# EAGLE design IoTv14 (EAGLE 7.6.0)
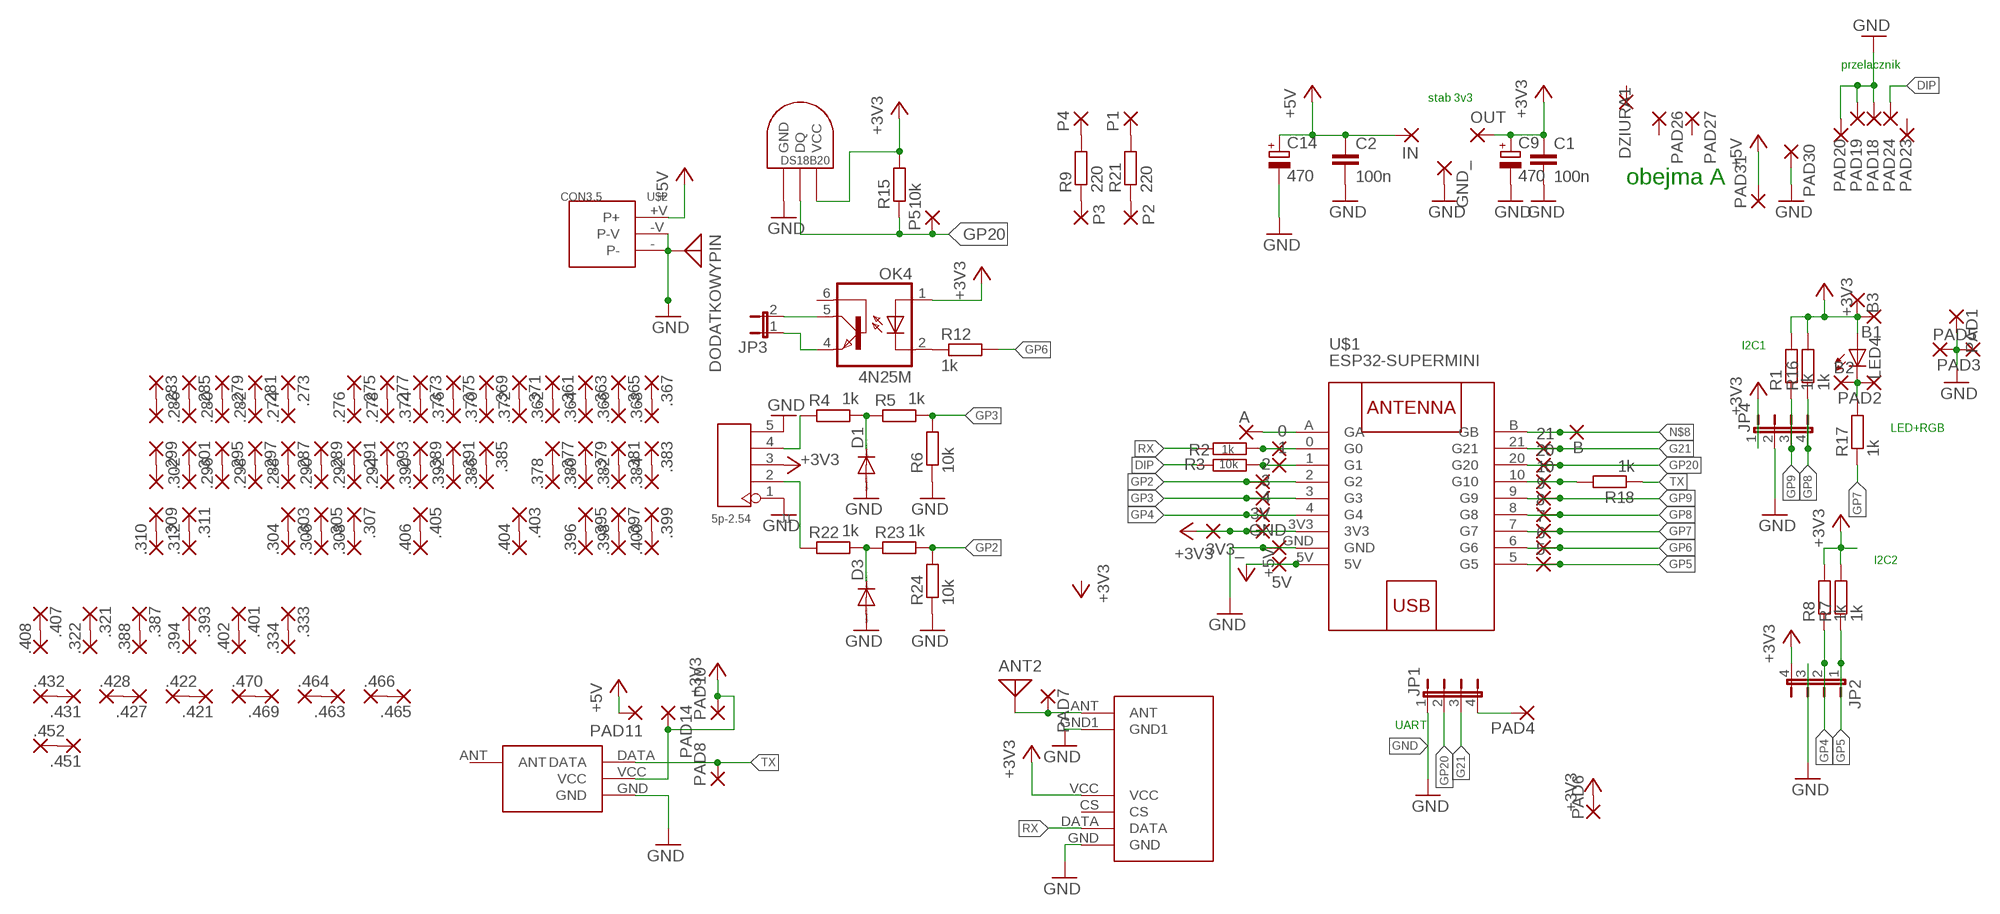
[diagram p0: schematic, sheet 1]

## Parts
0  1,6/0,8  [1,6/0,8]
1  1,6/0,8  [1,6/0,8]
2  1,6/0,8  [1,6/0,8]
3  1,6/0,8  [1,6/0,8]
3V  1,6/0,8  [1,6/0,8]
3V3_  1,6/0,8  [1,6/0,8]
4  1,6/0,8  [1,6/0,8]
5  1,6/0,8  [1,6/0,8]
5V  1,6/0,8  [1,6/0,8]
6  1,6/0,8  [1,6/0,8]
7  1,6/0,8  [1,6/0,8]
8  1,6/0,8  [1,6/0,8]
9  1,6/0,8  [1,6/0,8]
10  1,6/0,8  [1,6/0,8]
20  1,6/0,8  [1,6/0,8]
21  1,6/0,8  [1,6/0,8]
.273  1,6/0,8  [1,6/0,8]
.274  1,6/0,8  [1,6/0,8]
.275  1,6/0,8  [1,6/0,8]
.276  1,6/0,8  [1,6/0,8]
.277  1,6/0,8  [1,6/0,8]
.278  1,6/0,8  [1,6/0,8]
.279  1,6/0,8  [1,6/0,8]
.280  1,6/0,8  [1,6/0,8]
.281  1,6/0,8  [1,6/0,8]
.282  1,6/0,8  [1,6/0,8]
.283  1,6/0,8  [1,6/0,8]
.284  1,6/0,8  [1,6/0,8]
.285  1,6/0,8  [1,6/0,8]
.286  1,6/0,8  [1,6/0,8]
.287  1,6/0,8  [1,6/0,8]
.288  1,6/0,8  [1,6/0,8]
.289  1,6/0,8  [1,6/0,8]
.290  1,6/0,8  [1,6/0,8]
.291  1,6/0,8  [1,6/0,8]
.292  1,6/0,8  [1,6/0,8]
.293  1,6/0,8  [1,6/0,8]
.294  1,6/0,8  [1,6/0,8]
.295  1,6/0,8  [1,6/0,8]
.296  1,6/0,8  [1,6/0,8]
.297  1,6/0,8  [1,6/0,8]
.298  1,6/0,8  [1,6/0,8]
.299  1,6/0,8  [1,6/0,8]
.300  1,6/0,8  [1,6/0,8]
.301  1,6/0,8  [1,6/0,8]
.302  1,6/0,8  [1,6/0,8]
.303  1,6/0,8  [1,6/0,8]
.304  1,6/0,8  [1,6/0,8]
.305  1,6/0,8  [1,6/0,8]
.306  1,6/0,8  [1,6/0,8]
.307  1,6/0,8  [1,6/0,8]
.308  1,6/0,8  [1,6/0,8]
.309  1,6/0,8  [1,6/0,8]
.310  1,6/0,8  [1,6/0,8]
.311  1,6/0,8  [1,6/0,8]
.312  1,6/0,8  [1,6/0,8]
.321  1,6/0,8  [1,6/0,8]
.322  1,6/0,8  [1,6/0,8]
.333  1,6/0,8  [1,6/0,8]
.334  1,6/0,8  [1,6/0,8]
.361  1,6/0,8  [1,6/0,8]
.362  1,6/0,8  [1,6/0,8]
.363  1,6/0,8  [1,6/0,8]
.364  1,6/0,8  [1,6/0,8]
.365  1,6/0,8  [1,6/0,8]
.366  1,6/0,8  [1,6/0,8]
.367  1,6/0,8  [1,6/0,8]
.368  1,6/0,8  [1,6/0,8]
.369  1,6/0,8  [1,6/0,8]
.370  1,6/0,8  [1,6/0,8]
.371  1,6/0,8  [1,6/0,8]
.372  1,6/0,8  [1,6/0,8]
.373  1,6/0,8  [1,6/0,8]
.374  1,6/0,8  [1,6/0,8]
.375  1,6/0,8  [1,6/0,8]
.376  1,6/0,8  [1,6/0,8]
.377  1,6/0,8  [1,6/0,8]
.378  1,6/0,8  [1,6/0,8]
.379  1,6/0,8  [1,6/0,8]
.380  1,6/0,8  [1,6/0,8]
.381  1,6/0,8  [1,6/0,8]
.382  1,6/0,8  [1,6/0,8]
.383  1,6/0,8  [1,6/0,8]
.384  1,6/0,8  [1,6/0,8]
.385  1,6/0,8  [1,6/0,8]
.386  1,6/0,8  [1,6/0,8]
.387  1,6/0,8  [1,6/0,8]
.388  1,6/0,8  [1,6/0,8]
.389  1,6/0,8  [1,6/0,8]
.390  1,6/0,8  [1,6/0,8]
.391  1,6/0,8  [1,6/0,8]
.392  1,6/0,8  [1,6/0,8]
.393  1,6/0,8  [1,6/0,8]
.394  1,6/0,8  [1,6/0,8]
.395  1,6/0,8  [1,6/0,8]
.396  1,6/0,8  [1,6/0,8]
.397  1,6/0,8  [1,6/0,8]
.398  1,6/0,8  [1,6/0,8]
.399  1,6/0,8  [1,6/0,8]
.400  1,6/0,8  [1,6/0,8]
.401  1,6/0,8  [1,6/0,8]
.402  1,6/0,8  [1,6/0,8]
.403  1,6/0,8  [1,6/0,8]
.404  1,6/0,8  [1,6/0,8]
.405  1,6/0,8  [1,6/0,8]
.406  1,6/0,8  [1,6/0,8]
.407  1,6/0,8  [1,6/0,8]
.408  1,6/0,8  [1,6/0,8]
.421  1,6/0,8  [1,6/0,8]
.422  1,6/0,8  [1,6/0,8]
.427  1,6/0,8  [1,6/0,8]
.428  1,6/0,8  [1,6/0,8]
.431  1,6/0,8  [1,6/0,8]
.432  1,6/0,8  [1,6/0,8]
.451  1,6/0,8  [1,6/0,8]
.452  1,6/0,8  [1,6/0,8]
.463  1,6/0,8  [1,6/0,8]
.464  1,6/0,8  [1,6/0,8]
.465  1,6/0,8  [1,6/0,8]
.466  1,6/0,8  [1,6/0,8]
.469  1,6/0,8  [1,6/0,8]
.470  1,6/0,8  [1,6/0,8]
A  1,6/0,8  [1,6/0,8]
ANT2  ANTENNA  [PAD-01]
B  1,6/0,8  [1,6/0,8]
B1  1,6/0,8  [1,6/0,8]
B2  1,6/0,8  [1,6/0,8]
B3  1,6/0,8  [1,6/0,8]
C1  100n  C5/2.5  [C5B2.5]
C2  100n  C5/2.5  [C5B2.5]
C9  470  CPOL-EUE2,5-6E  [E2,5-6E]
C14  470  CPOL-EUE2,5-6E  [E2,5-6E]
D1  DIODE-DO41-7.6  [DO41-7.6]
D3  DIODE-DO41-7.6  [DO41-7.6]
DODATKOWYPIN  ANTENNA  [PAD-01]
DZIURA1  3,81/1,4  [3,81/1,4]
GND  1,6/0,8  [1,6/0,8]
GND_  1,6/0,9  [1,6/0,9]
IN  1,6/0,9  [1,6/0,9]
J1  5p-2.54  DIP-BLACK-FEMALE-HEADER-VERT(5P-2.54)  [H5-2.54]
JP1  JP4E  [JP4]
JP2  JP4E  [JP4]
JP3  JP1E  [JP1]
JP4  JP4E  [JP4]
LED4  LED3MM  [LED3MM]
OK4  4N25M  [DIL06]
OUT  1,6/0,9  [1,6/0,9]
P1  1,6/0,8  [1,6/0,8]
P2  1,6/0,8  [1,6/0,8]
P3  1,6/0,8  [1,6/0,8]
P4  1,6/0,8  [1,6/0,8]
P5  1,6/0,8  [1,6/0,8]
PAD1  1,6/0,8  [1,6/0,8]
PAD2  1,6/0,8  [1,6/0,8]
PAD3  1,6/0,8  [1,6/0,8]
PAD4  1,6/0,8  [1,6/0,8]
PAD5  1,6/0,8  [1,6/0,8]
PAD6  1,6/0,8  [1,6/0,8]
PAD7  1,6/0,8  [1,6/0,8]
PAD8  1,6/0,8  [1,6/0,8]
PAD10  1,6/0,8  [1,6/0,8]
PAD11  1,6/0,8  [1,6/0,8]
PAD14  1,6/0,8  [1,6/0,8]
PAD18  2,15/1,0  [2,15/1,0]
PAD19  2,15/1,0  [2,15/1,0]
PAD20  3,81/1,4  [3,81/1,4]
PAD23  3,81/1,4  [3,81/1,4]
PAD24  2,15/1,0  [2,15/1,0]
PAD26  2,15/1,0  [2,15/1,0]
PAD27  2,15/1,0  [2,15/1,0]
PAD30  3,81/1,4  [3,81/1,4]
PAD31  3,81/1,4  [3,81/1,4]
R1  1k  R-EU_0204/7  [0204/7]
R2  1k  R-EU_0204/7  [0204/7]
R3  10k  R-EU_0204/7  [0204/7]
R4  1k  R-EU_0204/7  [0204/7]
R5  1k  R-EU_0204/7  [0204/7]
R6  10k  R-EU_0204/7  [0204/7]
R7  1k  R-EU_0204/7  [0204/7]
R8  1k  R-EU_0204/7  [0204/7]
R9  220  R-EU_0204/7  [0204/7]
R12  1k  R-EU_0204/7  [0204/7]
R15  10k  R-EU_0204/7  [0204/7]
R16  1k  R-EU_0204/7  [0204/7]
R17  1k  R-EU_0204/7  [0204/7]
R18  1k  R-EU_0204/7  [0204/7]
R21  220  R-EU_0204/7  [0204/7]
R22  1k  R-EU_0204/7  [0204/7]
R23  1k  R-EU_0204/7  [0204/7]
R24  10k  R-EU_0204/7  [0204/7]
U$1  ESP32-SUPERMINI  [ESP32-SUPERMINI]
U$2  CON3.5  [CON3.5]
U$9  DS1820TO92  [DS1820]
U$10  STX882  [STX882]
U$11  SRX822  [SRX882]

## Nets
+3V3: 3V3_.1(P) 3V.1(P) B1.1(P) B3.1(P) C1.1 C9.+ J1.3 JP2.4 JP4.1 LED4.A OK4.1(A) OUT.1(P) PAD6.1(P) PAD10.1(P) PAD14.1(P) R1.2 R7.2 R8.2 R15.2 R16.2 U$1.3V3 U$9.VDD(VCC) U$10.VCC U$11.VCC
+5V: 5V.1(P) C2.1 C14.+ IN.1(P) PAD11.1(P) PAD31.1(P) U$1.5V U$2.+V(P+)
DIP: PAD24.1(P) R3.2
G21: 21.1(P) JP1.3 U$1.21(G21)
GND: C1.2 C2.2 C9.- C14.- D1.A D3.A DODATKOWYPIN.1 GND.1(P) GND_.1(P) J1.1 J1.5 JP1.1 JP2.3 JP4.2 PAD1.1(P) PAD3.1(P) PAD5.1(P) PAD18.1(P) PAD19.1(P) PAD20.1(P) PAD30.1(P) R6.1 R24.1 U$1.GND U$2.- U$2.-V U$9.GND U$10.GND U$11.GND U$11.GND1
GP2: 2.1(P) R23.2 R24.2 U$1.2(G2)
GP3: 3.1(P) R5.2 R6.2 U$1.3(G3)
GP4: 4.1(P) JP2.2 R8.1 U$1.4(G4)
GP5: 5.1(P) JP2.1 R7.1 U$1.5(G5)
GP6: 6.1(P) R12.2 U$1.6(G6)
GP7: 7.1(P) R17.1 U$1.7(G7)
GP8: 8.1(P) JP4.4 R16.1 U$1.8(G8)
GP9: 9.1(P) JP4.3 R1.1 U$1.9(G9)
GP20: 20.1(P) JP1.2 P5.1(P) R15.1 U$1.20(G20) U$9.DQ
N$1: 0.1(P) R2.2 U$1.0(G0)
N$2: 1.1(P) R3.1 U$1.1(G1)
N$3: 10.1(P) R18.2 U$1.10(G10)
N$4: D1.C R4.2 R5.1
N$5: JP3.2 OK4.5(COL)
N$6: J1.4 R4.1
N$7: J1.2 R22.1
N$8: B.1(P) U$1.B(GB)
N$9: JP1.4 PAD4.1(P)
N$10: A.1(P) U$1.A(GA)
N$11: P1.1(P) R21.2
N$12: P3.1(P) R9.1
N$13: P4.1(P) R9.2
N$42: JP3.1 OK4.4(EMI)
N$43: ANT2.1 PAD7.1(P) U$11.ANT
N$172: .273.1(P) .274.1(P)
N$173: .275.1(P) .276.1(P)
N$174: .277.1(P) .278.1(P)
N$175: .279.1(P) .280.1(P)
N$176: .281.1(P) .282.1(P)
N$177: .283.1(P) .284.1(P)
N$178: .285.1(P) .286.1(P)
N$179: .287.1(P) .288.1(P)
N$180: .289.1(P) .290.1(P)
N$181: .291.1(P) .292.1(P)
N$182: .293.1(P) .294.1(P)
N$183: .295.1(P) .296.1(P)
N$184: .297.1(P) .298.1(P)
N$185: .299.1(P) .300.1(P)
N$186: .301.1(P) .302.1(P)
N$187: .303.1(P) .304.1(P)
N$188: .305.1(P) .306.1(P)
N$189: .307.1(P) .308.1(P)
N$190: .309.1(P) .310.1(P)
N$191: .311.1(P) .312.1(P)
N$196: .321.1(P) .322.1(P)
N$202: .333.1(P) .334.1(P)
N$216: .361.1(P) .362.1(P)
N$217: .363.1(P) .364.1(P)
N$218: .365.1(P) .366.1(P)
N$219: .367.1(P) .368.1(P)
N$220: .369.1(P) .370.1(P)
N$221: .371.1(P) .372.1(P)
N$222: .373.1(P) .374.1(P)
N$223: .375.1(P) .376.1(P)
N$224: .377.1(P) .378.1(P)
N$225: .379.1(P) .380.1(P)
N$226: .381.1(P) .382.1(P)
N$227: .383.1(P) .384.1(P)
N$228: .385.1(P) .386.1(P)
N$229: .387.1(P) .388.1(P)
N$230: .389.1(P) .390.1(P)
N$231: .391.1(P) .392.1(P)
N$232: .393.1(P) .394.1(P)
N$233: .395.1(P) .396.1(P)
N$234: .397.1(P) .398.1(P)
N$235: .399.1(P) .400.1(P)
N$236: .401.1(P) .402.1(P)
N$237: .403.1(P) .404.1(P)
N$238: .405.1(P) .406.1(P)
N$239: .407.1(P) .408.1(P)
N$246: .421.1(P) .422.1(P)
N$249: .427.1(P) .428.1(P)
N$251: .431.1(P) .432.1(P)
N$261: .451.1(P) .452.1(P)
N$267: .463.1(P) .464.1(P)
N$268: .465.1(P) .466.1(P)
N$270: .469.1(P) .470.1(P)
N$273: B2.1(P) LED4.K(C) PAD2.1(P) R17.2
N$281: P2.1(P) R21.1
N$283: D3.C R22.2 R23.1
N$288: OK4.2(C) R12.1
RX: R2.1 U$11.DATA
TX: PAD8.1(P) R18.1 U$10.DATA
Unconnected: DZIURA1.1(P) OK4.6(BAS) PAD23.1(P) PAD26.1(P) PAD27.1(P) U$10.ANT U$11.CS

## Notes on the sheet
- przelacznik
- stab 3v3
- obejma A
- I2C1
- LED+RGB
- I2C2
- UART

## Library data of the parts
0 1-3 3V 3V3_ 4 5 5V 6-10 20 21 .273-.312 .321 .322 .333 .334 .361-.408 .421 .422 .427 .428 .431 .432 .451 .452 .463-.466 .469 .470 A B B1-B3 GND P1-P5 PAD1-PAD8 PAD10 PAD11 PAD14 = wirepad:1,6/0,8: THROUGH-HOLE PAD
ANT2 DODATKOWYPIN = moja2:ANTENNA: Antenna
C1 C2 = capacitor-wima:C: CAPACITOR naming: grid - package width
C9 C14 = resistor:CPOL-EU: POLARIZED CAPACITOR, European symbol
D1 D3 = diode:DIODE-: DIODE
DZIURA1 PAD20 PAD23 PAD30 PAD31 = wirepad:3,81/1,4: THROUGH-HOLE PAD
GND_ IN OUT = wirepad:1,6/0,9: THROUGH-HOLE PAD
J1 = Seeed-OPL-Connector:DIP-BLACK-FEMALE-HEADER-VERT(5P-2.54): 320030028; MPN: F185-1105A0BSYA1
JP1 JP2 JP4 = jumper:JP4E: JUMPER
JP3 = jumper:JP1E: JUMPER
LED4 = czesci:LED: LED OSRAM: - CHIPLED LG R971, LG N971, LY N971, LG Q971, LY Q971, LO R971, LY R971 LH N974, LH R974 LS Q976, LO Q976, LY Q976 LO Q996 - Hyper CHIPLED LW Q18S LB Q993, LB Q99A, LB R99A - SideLED LS A670, LO A670, LY A670, LG A670, LP A670 LB A673, LV A673, LT A673, LW A673 LH A674 LY A675 LS A676, LA A676, LO A676, LY A676, LW A676 LS A679, LY A679, LG A679 - Hyper Micro SIDELED® LS Y876, LA Y876, LO Y876, LY Y876 LT Y87S - SmartLED LW L88C, LW L88S LB L89C, LB L89S, LG L890 LS L89K, LO L89K, LY L89K LS L896, LA L896, LO L896, LY L896 - TOPLED LS T670, LO T670, LY T670, LG T670, LP T670 LSG T670, LSP T670, LSY T670, LOP T670, LYG T670 LG T671, LOG T671, LSG T671 LB T673, LV T673, LT T673, LW T673 LH T674 LS T676, LA T676, LO T676, LY T676, LB T676, LH T676, LSB T676, LW T676 LB T67C, LV T67C, LT T67C, LS T67K, LO T67K, LY T67K, LW E67C LS E67B, LA E67B, LO E67B, LY E67B, LB E67C, LV E67C, LT E67C LW T67C LS T679, LY T679, LG T679 LS T770, LO T770, LY T770, LG T770, LP T770 LB T773, LV T773, LT T773, LW T773 LH T774 LS E675, LA E675, LY E675, LS T675 LS T776, LA T776, LO T776, LY T776, LB T776 LHGB T686 LT T68C, LB T68C - Hyper Mini TOPLED® LB M676 - Mini TOPLED Santana® LG M470 LS M47K, LO M47K, LY M47K Source: http://www.osram.convergy.de LUXEON: - LUMILED® LXK2-PW12-R00, LXK2-PW12-S00, LXK2-PW14-U00, LXK2-PW14-V00 LXK2-PM12-R00, LXK2-PM12-S00, LXK2-PM14-U00 LXK2-PE12-Q00, LXK2-PE12-R00, LXK2-PE12-S00, LXK2-PE14-T00, LXK2-PE14-U00 LXK2-PB12-K00, LXK2-PB12-L00, LXK2-PB12-M00, LXK2-PB14-N00, LXK2-PB14-P00, LXK2-PB14-Q00 LXK2-PR12-L00, LXK2-PR12-M00, LXK2-PR14-Q00, LXK2-PR14-R00 LXK2-PD12-Q00, LXK2-PD12-R00, LXK2-PD12-S00 LXK2-PH12-R00, LXK2-PH12-S00 LXK2-PL12-P00, LXK2-PL12-Q00, LXK2-PL12-R00 Source: www.luxeon.com KINGBRIGHT: KA-3528ASYC Source: www.kingbright.com
OK4 = optocoupler:4N*?M: General Purpose 6-Pin Phototransistor Optocouplers Source: http://www.fairchildsemi.com/ds/4N/4N35-M.pdf; MPN: 4N25-M; OC_FARNELL: 1021349; OC_NEWARK: 98K9084
PAD18 PAD19 PAD24 PAD26 PAD27 = wirepad:2,15/1,0: THROUGH-HOLE PAD
R1-R9 R12 R15-R18 R21-R24 = resistor:R-EU_: RESISTOR, European symbol
U$1 = ESP32supermini:ESP32-SUPERMINI: WEMOS D1 mini: Mini Wi-Fi Board based on ESP-8266 device More details can be found here: https://www.wemos.cc/product/d1-mini.html Click here to find device on ebay.com <http://www.ebay.com/sch/wemos+d1+mini+nodemcu>
U$2 = connector3.5:CON3.5
U$9 = Ava:DS1820: DS18B20 Programmable Resolution 1-Wire Digital Thermometer Description The DS18B20 digital thermometer provides 9-bit to 12-bit Celsius temperature measurements and has an alarm function with nonvolatile user-programmable upper and lower trigger points. The DS18B20 communicates over a 1-Wire® bus that by definition requires only one data line (and ground) for communication with a central microprocessor. It has an operating temperature range of -55°C to +125°C and is accurate to ±0.5°C over the range of -10°C to +85°C. In addition, the DS18B20 can derive power directly from the data line ("parasite power"), eliminating the need for an external power supply. Each DS18B20 has a unique 64-bit serial code, which allows multiple DS18B20s to function on the same 1-Wire bus. Thus, it is simple to use one microprocessor to control many DS18B20s distributed over a large area. Applications that can benefit from this feature include HVAC environmental controls, temperature monitoring systems inside buildings, equipment, or machinery, and process monitoring and control systems.
U$10 = stx882:STX882
U$11 = srx882:SRX822

## Board
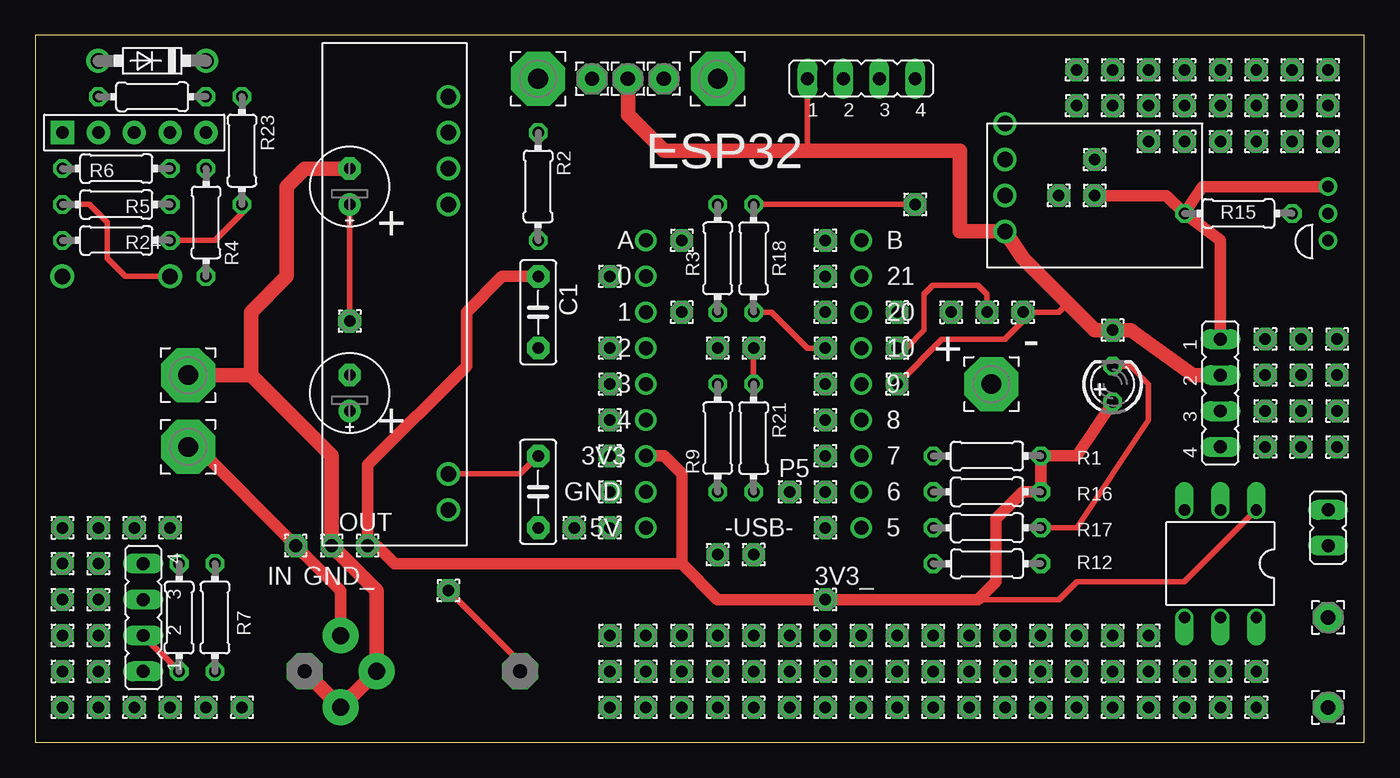
[diagram p1: board, top side]
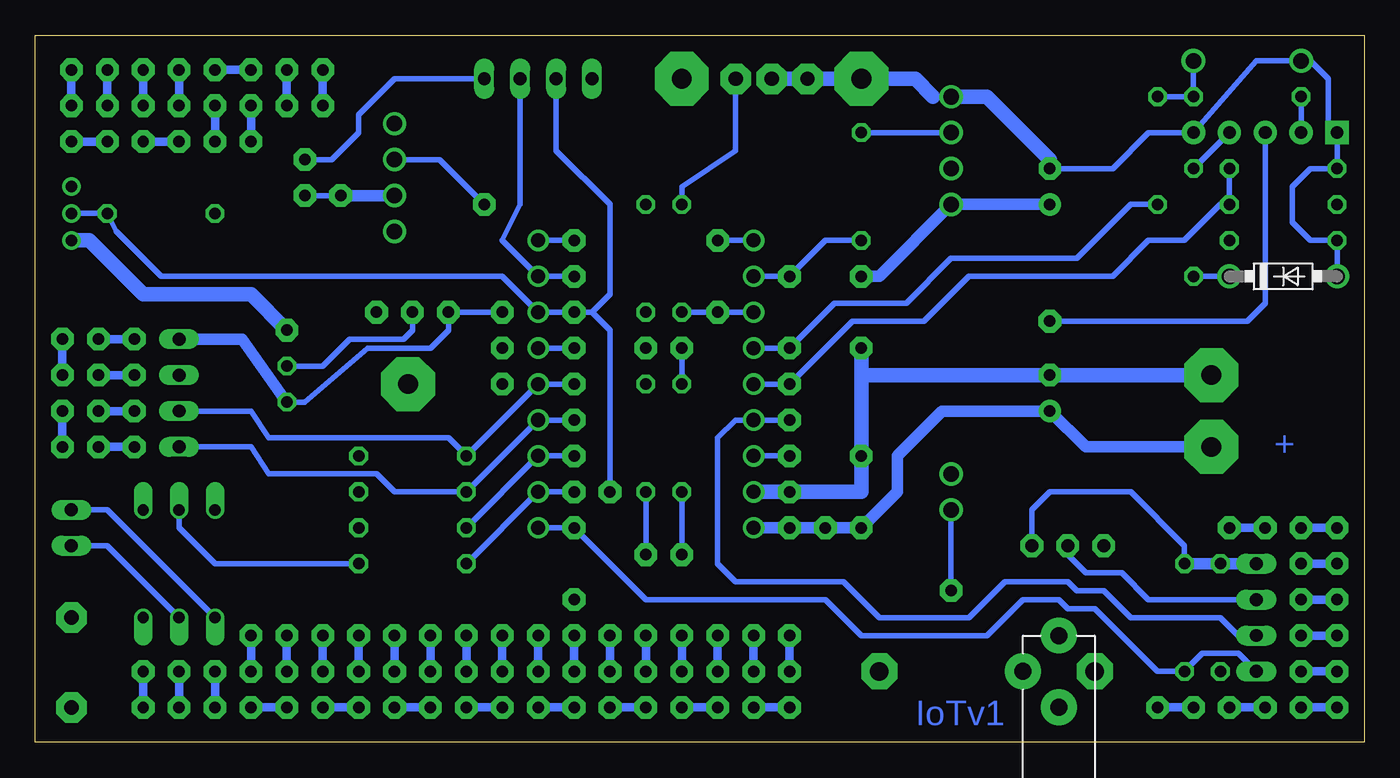
[diagram p2: board, bottom side, seen from below]

Size 94 x 50 mm. Coordinates in mm from the lower left corner, seen from the top.
Outline: 0,0 94,0 94,50 0,50 0,0
Copper layers (1*16): Top 0.035mm / dielectric 1.5mm / Bottom 0.035mm
Design rules "default *": minimum track width 10mil, minimum drill 24mil, track to track 8mil, track to pad 8mil, pad to pad 8mil, via to via 8mil, smd to smd 8mil, copper to edge 40mil, drill to drill 8mil, minimum pad ring 10mil, minimum via ring 8mil, stop-mask expansion 4mil, vias tented up to drill 0mil, thermal gap 10mil

### Footprints (pad centres in the part's own frame; a part is rotated, then mirrored left to right if it is on the bottom)
1,6/0,8 = drill 0.813 pad 1.6 octagon: 1 0,0
PAD-01 = drill 1.321 pad 2.54 octagon: 1 0,0
C5B2.5 = drill 0.813 pad 1.6 octagon: 1 -2.54,0; 2 2.54,0
E2,5-6E = drill 0.813 pad 1.575: + -1.27,0 | drill 0.813 pad 1.575 octagon: - 1.27,0
DO41-7.6 = drill 1.1 pad 1.7: A 3.81,0; C -3.81,0
3,81/1,4 = drill 1.397 pad 3.81 octagon: 1 0,0
1,6/0,9 = drill 0.914 pad 1.6 octagon: 1 0,0
H5-2.54 = drill 0.889 pad 1.651 square: 1 0,5.08 | drill 0.889 pad 1.651: 2 0,2.54; 3 0,0; 4 0,-2.54; 5 0,-5.08
JP4 = drill 0.914 long: 1 -3.81,0; 2 -1.27,0; 3 1.27,0; 4 3.81,0
JP1 = drill 0.914 long: 1 0,-1.27; 2 0,1.27
LED3MM = drill 0.813 octagon: A -1.27,0; K 1.27,0
DIL06 = drill 0.813 offset: 1 -2.54,-3.81; 2 0,-3.81; 3 2.54,-3.81; 4 2.54,3.81; 5 0,3.81; 6 -2.54,3.81
2,15/1,0 = drill 1.016 pad 2.159 octagon: 1 0,0
0204/7 = drill 0.813 octagon: 1 -3.81,0; 2 3.81,0
ESP32-SUPERMINI = drill 1: 0 -11.43,9.525; 1 -11.43,6.985; 2 -11.43,4.445; 3 -11.43,1.905; 3V3 -11.43,-3.175; 4 -11.43,-0.635; 5 3.81,-8.255; 5V -11.43,-8.255; 6 3.81,-5.715; 7 3.81,-3.175; 8 3.81,-0.635; 9 3.81,1.905; 10 3.81,4.445; 20 3.81,6.985; 21 3.81,9.525; A -11.43,12.065; B 3.81,12.065; GND -11.43,-5.715
CON3.5 = drill 1.2 pad 2.54: +V 2.54,-1.27; - -2.54,-1.27; -V 0,1.27
DS1820 = drill 0.8: DQ 2.54,-1.27; GND 0.635,-1.27; VDD 4.445,-1.27
STX882 = drill 1.1: ANT 6.35,-5.08; DATA 6.35,-2.54; GND 6.35,2.54; VCC 6.35,0
SRX882 = drill 1.1: ANT -15.24,-3.81; CS 8.89,-3.81; DATA 11.43,-3.81; GND 13.97,-3.81; GND1 -12.7,-3.81; VCC 6.35,-3.81

### Placement (x,y rotation side)
0  40.65,32.96 0 top
1  45.73,30.42 0 top
2  40.65,27.88 0 top
3  40.65,25.34 0 top
3V  40.65,20.26 0 top
3V3_  55.89,10.1 0 top
4  40.65,22.8 0 top
5  55.89,15.18 0 top
5V  40.65,15.18 0 top
6  55.89,17.72 0 top
7  55.89,20.26 0 top
8  55.89,22.8 0 top
9  55.89,25.34 0 top
10  55.89,27.88 0 top
20  55.89,30.42 0 top
21  55.89,32.96 0 top
.273  83.83,45.03 0 top
.274  83.83,47.56 0 top
.275  88.91,47.56 0 top
.276  88.91,45.03 0 top
.277  91.45,45.03 0 top
.278  91.45,47.56 0 top
.279  83.83,2.48 0 top
.280  83.83,5.02 0 top
.281  91.45,42.48 0 top
.282  88.91,42.48 0 top
.283  73.67,45.03 0 top
.284  73.67,47.56 0 top
.285  76.21,45.03 0 top
.286  76.21,47.56 0 top
.287  60.97,2.48 0 top
.288  63.51,2.48 0 top
.289  81.29,47.56 0 top
.290  78.75,47.56 0 top
.291  81.29,45.03 0 top
.292  81.29,42.48 0 top
.293  86.37,47.56 0 top
.294  86.37,45.03 0 top
.295  73.67,7.56 0 top
.296  73.67,5.02 0 top
.297  83.83,42.48 0 top
.298  86.37,42.48 0 top
.299  76.21,2.48 0 top
.300  78.75,2.48 0 top
.301  68.59,2.48 0 top
.302  66.05,2.48 0 top
.303  40.65,5.02 0 top
.304  40.65,7.56 0 top
.305  71.13,2.48 0 top
.306  73.67,2.48 0 top
.307  89.55,23.44 0 top
.308  87.01,23.44 0 top
.309  78.75,42.48 0 top
.310  78.75,45.03 0 top
.311  81.29,2.48 0 top
.312  81.29,5.02 0 top
.321  1.92,15.18 90 top
.322  4.46,15.18 90 top
.333  86.37,2.48 0 top
.334  86.37,5.02 0 top
.361  40.65,2.48 0 top
.362  43.19,2.48 0 top
.363  45.73,2.48 0 top
.364  48.27,2.48 0 top
.365  78.75,7.56 0 top
.366  78.75,5.02 0 top
.367  50.81,5.02 0 top
.368  50.81,7.56 0 top
.369  48.27,5.02 0 top
.370  48.27,7.56 0 top
.371  53.35,7.56 0 top
.372  53.35,5.02 0 top
.373  58.43,5.02 0 top
.374  58.43,7.56 0 top
.375  60.97,7.56 0 top
.376  60.97,5.02 0 top
.377  45.73,5.02 0 top
.378  45.73,7.56 0 top
.379  55.89,7.56 0 top
.380  55.89,5.02 0 top
.381  50.81,2.48 0 top
.382  53.35,2.48 0 top
.383  58.43,2.48 0 top
.384  55.89,2.48 0 top
.385  63.51,5.02 90 top
.386  63.51,7.56 90 top
.387  4.46,10.1 90 top
.388  1.92,10.1 90 top
.389  71.13,5.02 90 top
.390  71.13,7.56 90 top
.391  66.05,5.02 90 top
.392  66.05,7.56 90 top
.393  4.46,7.56 90 top
.394  1.92,7.56 90 top
.395  68.59,5.02 90 top
.396  68.59,7.56 90 top
.397  76.21,7.56 90 top
.398  76.21,5.02 90 top
.399  87.01,20.9 90 top
.400  89.55,20.9 90 top
.401  1.92,5.02 90 top
.402  4.46,5.02 90 top
.403  87.01,25.98 90 top
.404  89.55,25.98 90 top
.405  92.09,23.44 90 top
.406  92.09,20.9 90 top
.407  4.46,12.64 90 top
.408  1.92,12.64 90 top
.421  7,2.48 0 top
.422  9.54,2.48 0 top
.427  92.09,28.52 0 top
.428  92.09,25.98 0 top
.431  43.19,7.56 0 top
.432  43.19,5.02 0 top
.451  87.01,28.52 0 top
.452  89.55,28.52 0 top
.463  7,15.18 0 top
.464  9.54,15.18 0 top
.465  1.92,2.48 0 top
.466  4.46,2.48 0 top
.469  14.61,2.48 0 top
.470  12.07,2.48 0 top
A  45.73,35.5 0 top
ANT2  34.3,5.02 0 top
B  55.89,35.5 0 top
B1  64.78,30.42 90 top
B2  60.97,27.88 0 top
B3  60.97,30.42 0 top
C1  35.57,30.42 270 top
C2  35.57,17.72 90 top
C9  22.23,39.31 90 top
C14  22.23,24.7 90 top
D1  5.73,32.96 0 bottom
D3  8.27,48.2 180 top
DODATKOWYPIN  19.06,5.02 0 top
DZIURA1  67.64,25.34 0 top
GND  40.65,17.72 0 top
GND_  20.96,13.91 0 top
IN  18.43,13.91 0 top
J1  7,43.12 90 top
JP1  58.43,46.93 0 top
JP2  7.63,8.83 90 top
JP3  91.45,15.18 180 top
JP4  83.83,24.7 270 top
LED4  76.21,25.34 90 top
OK4  83.83,12.64 180 top
OUT  23.5,13.91 0 top
P1  50.81,13.27 0 top
P2  50.81,27.88 0 top
P3  48.27,13.27 0 top
P4  48.27,27.88 0 top
P5  53.35,17.72 0 top
PAD1  76.21,29.15 0 top
PAD2  67.32,30.42 0 top
PAD3  69.86,30.42 90 top
PAD4  74.94,41.22 0 top
PAD5  60.97,25.34 0 top
PAD6  22.23,29.78 0 top
PAD7  29.22,10.73 0 top
PAD8  62.24,38.04 0 top
PAD10  74.94,38.67 0 top
PAD11  38.11,15.18 0 top
PAD14  72.4,38.67 0 top
PAD18  41.92,46.93 0 top
PAD19  39.38,46.93 0 top
PAD20  35.57,46.93 0 top
PAD23  48.27,46.93 0 top
PAD24  44.46,46.93 0 top
PAD26  91.45,8.83 0 top
PAD27  91.45,2.48 0 top
PAD30  10.8,25.98 0 top
PAD31  10.8,20.9 0 top
R1  67.32,20.26 0 top
R2  35.57,39.31 270 top
R3  48.27,34.23 90 top
R4  12.07,36.77 270 top
R5  5.73,38.04 0 top
R6  5.73,40.58 0 top
R7  12.71,8.83 90 top
R8  10.17,8.83 90 top
R9  48.27,21.53 90 top
R12  67.32,12.64 180 top
R15  85.1,37.41 180 top
R16  67.32,17.72 0 top
R17  67.32,15.18 0 top
R18  50.81,34.23 270 top
R21  50.81,21.53 270 top
R22  8.27,45.66 0 top
R23  14.61,41.85 270 top
R24  5.73,35.5 0 top
U$1  54.62,23.44 0 top
U$2  22.87,5.02 90 bottom
U$9  90.18,34.87 90 top
U$10  74.94,38.67 180 top
U$11  25.41,31.69 90 top

### Tracks (layer width: path | path; a pad name or v marks a point on that pad's centre or on a via)
+3V3
  Top 0.406: OK4.1 81.29,11.37 73.67,11.37 72.4,10.1 66.69,10.1 | 24.14,13.91 OUT.1 | C9.+ PAD6.1
  Top 0.813: LED4.A 73.67,20.26 R1.2 R16.2 69.86,17.72 67.95,15.81 67.95,11.37 66.69,10.1 3V3_.1 48.27,10.1 45.73,12.64 | 45.73,12.64 45.73,18.99 44.46,20.26 U$1.3V3 | PAD10.1 80.02,38.67 R15.2 | R15.2 82.56,39.31 U$9.VDD | R15.2 83.83,35.5 JP4.1 | C1.1 33.03,32.96 30.49,30.42 30.49,26.61 23.5,19.62 OUT.1 | 45.73,12.64 25.41,12.64 24.14,13.91
  Bottom 0.406: PAD14.1 PAD10.1 | 3V.1 U$1.3V3 | LED4.A 74.94,24.07 70.5,27.88 66.05,27.88 64.78,29.15 B1.1 B3.1 | R7.2 12.71,13.91 16.52,17.72 22.23,17.72 23.5,16.45 OUT.1 | J1.3 7,31.05 8.27,29.78 PAD6.1
  Bottom 0.813: JP4.1 79.39,28.52 LED4.A | R7.2 R8.2 JP2.4 | U$10.VCC PAD14.1 | C9.+ U$11.VCC 34.3,32.96 C1.1
+5V
  Top 0.813: U$2.+V 21.6,10.73 IN.1 11.44,20.9 PAD31.1
  Bottom 0.813: U$1.5V 5V.1 PAD11.1 C2.1 33.03,17.72 33.03,20.26 29.86,23.44 C14.+ 19.7,20.9 PAD31.1
DIP
  Bottom 0.406: PAD24.1 44.46,41.85 48.27,39.31 R3.2
G21
  Bottom 0.406: 21.1 U$1.21 60.97,35.5 59.7,38.04 JP1.3
GND
  Top 0.406: 73.03,31.05 72.4,30.42 PAD3.1 69.86,29.78 68.59,28.52 64.14,28.52 PAD5.1 | JP1.1 54.62,41.85 | U$11.GND1 34.3,18.99 C2.2
  Top 1.016: PAD18.1 41.92,44.39 44.46,41.85 54.62,41.85 65.42,41.85 65.42,36.14 U$10.GND 69.86,34.23 73.03,31.05 74.94,29.15 PAD1.1 77.48,29.15 81.92,25.98 JP4.2 | 15.25,25.98 20.96,20.26 GND_.1 24.14,10.73 U$2.-V U$2.- DODATKOWYPIN.1 | PAD30.1 15.25,25.98 | 15.25,25.98 15.25,30.42 17.79,32.96 17.79,39.31 19.06,40.58 C9.-
  Bottom 0.406: D3.A 3.82,48.2 2.55,46.93 2.55,43.75 J1.1 R6.1 3.82,40.58 5.09,39.31 5.09,36.77 3.82,35.5 R24.1 D1.A | 5.09,48.2 D3.A | D3.A 7.63,48.2 J1.5 15.25,43.12 17.79,40.58 C9.- 22.23,41.22 | U$11.GND 30.49,45.66 | JP2.3 15.25,10.1 17.15,12.01 19.7,12.01 20.96,13.27 GND_.1
  Bottom 1.016: U$1.GND GND.1 35.57,17.72 C2.2 35.57,25.98 | U$9.GND 90.18,35.5 86.37,31.69 78.75,31.69 PAD1.1 | 30.49,45.66 31.76,46.93 PAD20.1 PAD19.1 PAD18.1 | U$11.GND 26.68,45.66 22.23,41.22 | C1.2 35.57,25.98 | PAD30.1 C14.- 35.57,25.98
GP2
  Top 0.406: R23.2 14.61,37.41 12.71,35.5 R24.2
  Bottom 0.406: U$1.2 2.1 37.48,31.05 32.4,31.05 29.22,34.23 20.33,34.23 16.52,38.04 R23.2
GP3
  Bottom 0.406: U$1.3 3.1 36.21,29.78 31.12,29.78 27.95,32.96 17.79,32.96 15.25,35.5 12.71,35.5 10.17,38.04 R5.2 R6.2
GP4
  Top 0.406: R8.1 JP2.2
  Bottom 0.406: U$1.4 4.1 44.46,22.8 45.73,21.53 45.73,12.64 44.46,11.37 36.84,11.37 34.3,8.83 27.95,8.83 25.41,11.37 20.96,11.37 20.33,10.73 18.43,10.73 16.52,8.83 10.17,8.83 8.9,7.56 JP2.2
GP5
  Bottom 0.406: U$1.5 5.1 50.81,10.1 38.11,10.1 35.57,7.56 26.68,7.56 24.14,10.1 21.6,10.1 20.96,9.47 19.06,9.47 14.61,5.02 R7.1 11.44,6.29 8.9,6.29 JP2.1
GP6
  Bottom 0.406: R12.2 U$1.6 6.1
GP7
  Bottom 0.406: 7.1 U$1.7 R17.1
GP8
  Bottom 0.406: 8.1 U$1.8 R16.1 68.59,17.72 69.86,18.99 77.48,18.99 78.75,20.9 JP4.4
GP9
  Bottom 0.406: JP4.3 78.75,23.44 77.48,21.53 64.78,21.53 R1.1 U$1.9 9.1
GP20
  Bottom 0.406: U$9.DQ R15.1 88.28,36.14 85.1,32.96 60.97,32.96 U$1.20 20.1 54.62,30.42 | P5.1 53.35,29.15 54.62,30.42 | JP1.2 57.16,41.85 53.35,38.04 53.35,31.69 54.62,30.42
N$1
  Bottom 0.406: U$1.0 0.1 38.11,35.5 R2.2
N$2
  Bottom 0.406: R3.1 1.1 U$1.1
N$3
  Top 0.406: R18.2 52.08,30.42 54.62,27.88 10.1
  Bottom 0.406: 10.1 U$1.10
N$4
  Top 0.406: R5.1 3.82,38.04 5.09,36.77 5.09,34.23 6.36,32.96 D1.C
  Bottom 0.406: D1.C R4.2
N$5
  Bottom 0.406: OK4.5 88.91,13.91 JP3.2
N$6
  Bottom 0.406: J1.4 R4.1
N$7
  Bottom 0.406: J1.2 R22.1
N$8
  Bottom 0.406: U$1.B B.1
N$9
  Bottom 0.406: JP1.4 68.59,46.93 71.13,44.39 71.13,43.12 73.03,41.22 PAD4.1
N$10
  Bottom 0.406: U$1.A A.1
N$11
  Bottom 0.406: P1.1 R21.2
N$12
  Bottom 0.406: R9.1 P3.1
N$13
  Bottom 0.406: P4.1 R9.2
N$42
  Bottom 0.406: OK4.4 88.91,16.45 JP3.1
N$43
  Top 0.406: ANT2.1 34.3,5.66 PAD7.1
  Bottom 0.406: U$11.ANT PAD7.1
N$172
  Bottom 0.61: .274.1 .273.1
N$173
  Bottom 0.61: .276.1 .275.1
N$174
  Bottom 0.61: .278.1 .277.1
N$175
  Bottom 0.61: .280.1 .279.1
N$176
  Bottom 0.61: .282.1 .281.1
N$177
  Bottom 0.61: .284.1 .283.1
N$178
  Bottom 0.61: .286.1 .285.1
N$179
  Bottom 0.61: .288.1 .287.1
N$180
  Bottom 0.61: .290.1 .289.1
N$181
  Bottom 0.61: .292.1 .291.1
N$182
  Bottom 0.61: .293.1 .294.1
N$183
  Bottom 0.61: .295.1 .296.1
N$184
  Bottom 0.61: .298.1 .297.1
N$185
  Bottom 0.61: .299.1 .300.1
N$186
  Bottom 0.61: .302.1 .301.1
N$187
  Bottom 0.61: .303.1 .304.1
N$188
  Bottom 0.61: .306.1 .305.1
N$189
  Bottom 0.61: .308.1 .307.1
N$190
  Bottom 0.61: .309.1 .310.1
N$191
  Bottom 0.61: .311.1 .312.1
N$196
  Bottom 0.61: .322.1 .321.1
N$202
  Bottom 0.61: .333.1 .334.1
N$216
  Bottom 0.61: .361.1 .362.1
N$217
  Bottom 0.61: .363.1 .364.1
N$218
  Bottom 0.61: .366.1 .365.1
N$219
  Bottom 0.61: .368.1 .367.1
N$220
  Bottom 0.61: .370.1 .369.1
N$221
  Bottom 0.61: .371.1 .372.1
N$222
  Bottom 0.61: .374.1 .373.1
N$223
  Bottom 0.61: .375.1 .376.1
N$224
  Bottom 0.61: .377.1 .378.1
N$225
  Bottom 0.61: .379.1 .380.1
N$226
  Bottom 0.61: .382.1 .381.1
N$227
  Bottom 0.61: .383.1 .384.1
N$228
  Bottom 0.61: .385.1 .386.1
N$229
  Bottom 0.61: .387.1 .388.1
N$230
  Bottom 0.61: .389.1 .390.1
N$231
  Bottom 0.61: .391.1 .392.1
N$232
  Bottom 0.61: .393.1 .394.1
N$233
  Bottom 0.61: .396.1 .395.1
N$234
  Bottom 0.61: .397.1 .398.1
N$235
  Bottom 0.61: .400.1 .399.1
N$236
  Bottom 0.61: .401.1 .402.1
N$237
  Bottom 0.61: .404.1 .403.1
N$238
  Bottom 0.61: .405.1 .406.1
N$239
  Bottom 0.61: .408.1 .407.1
N$246
  Bottom 0.61: .422.1 .421.1
N$249
  Bottom 0.61: .428.1 .427.1
N$251
  Bottom 0.61: .431.1 .432.1
N$261
  Bottom 0.61: .451.1 .452.1
N$267
  Bottom 0.61: .463.1 .464.1
N$268
  Bottom 0.61: .465.1 .466.1
N$270
  Bottom 0.61: .469.1 .470.1
N$273
  Top 0.406: LED4.K 77.48,26.61 78.75,25.34 78.75,22.8 73.67,15.18 R17.2 | B2.1 61.61,27.88 62.88,29.15 62.88,31.69 63.51,32.33 66.69,32.33 67.32,31.69 PAD2.1
  Bottom 0.406: LED4.K 73.67,26.61 71.77,28.52 67.95,28.52 67.32,29.15 PAD2.1 67.32,31.05
N$281
  Top 0.406: R21.1 P2.1
N$283
  Bottom 0.406: R23.1 R22.2 D3.C
N$288
  Bottom 0.406: R12.1 81.29,12.64 83.83,15.18 OK4.2
RX
  Bottom 0.406: U$11.DATA R2.1
TX
  Top 0.406: R18.1 PAD8.1
  Bottom 0.406: U$10.DATA 65.42,41.22 PAD8.1

### Text on the board
Bottom: + | IoTv1
tPlace: ESP32 | + | + | - | +